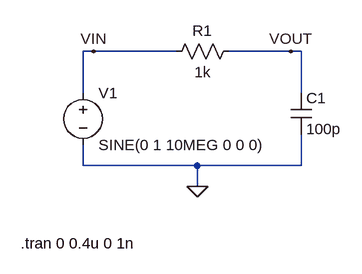
[diagram p0: schematic lab00_rc_filter.asc]
lab00_rc_filter.asc, the LTspice schematic file:
Version 4
SHEET 1 880 680
WIRE 128 80 112 80
WIRE 256 80 128 80
WIRE 432 80 336 80
WIRE 448 80 432 80
WIRE 112 144 112 80
WIRE 448 144 448 80
WIRE 112 256 112 224
WIRE 288 256 112 256
WIRE 448 256 448 208
WIRE 448 256 288 256
WIRE 288 288 288 256
FLAG 288 288 0
FLAG 128 80 VIN
FLAG 432 80 VOUT
SYMBOL voltage 112 128 R0
WINDOW 123 0 0 Left 0
WINDOW 39 0 0 Left 0
SYMATTR InstName V1
SYMATTR Value SINE(0 1 10MEG 0 0 0)
SYMBOL res 352 64 R90
WINDOW 0 0 56 VBottom 2
WINDOW 3 32 56 VTop 2
SYMATTR InstName R1
SYMATTR Value 1k
SYMBOL cap 432 144 R0
SYMATTR InstName C1
SYMATTR Value 100p
TEXT 16 376 Left 2 !.tran 0 0.4u 0 1n

The netlist it stands for:
* lab00_rc_filter.asc
V1 VIN 0 SINE(0 1 10MEG 0 0 0)
R1 VOUT VIN 1k
C1 VOUT 0 100p
.tran 0 0.4u 0 1n
.backanno
.end